# EAGLE design openWall_BasePCB (EAGLE 6.4)
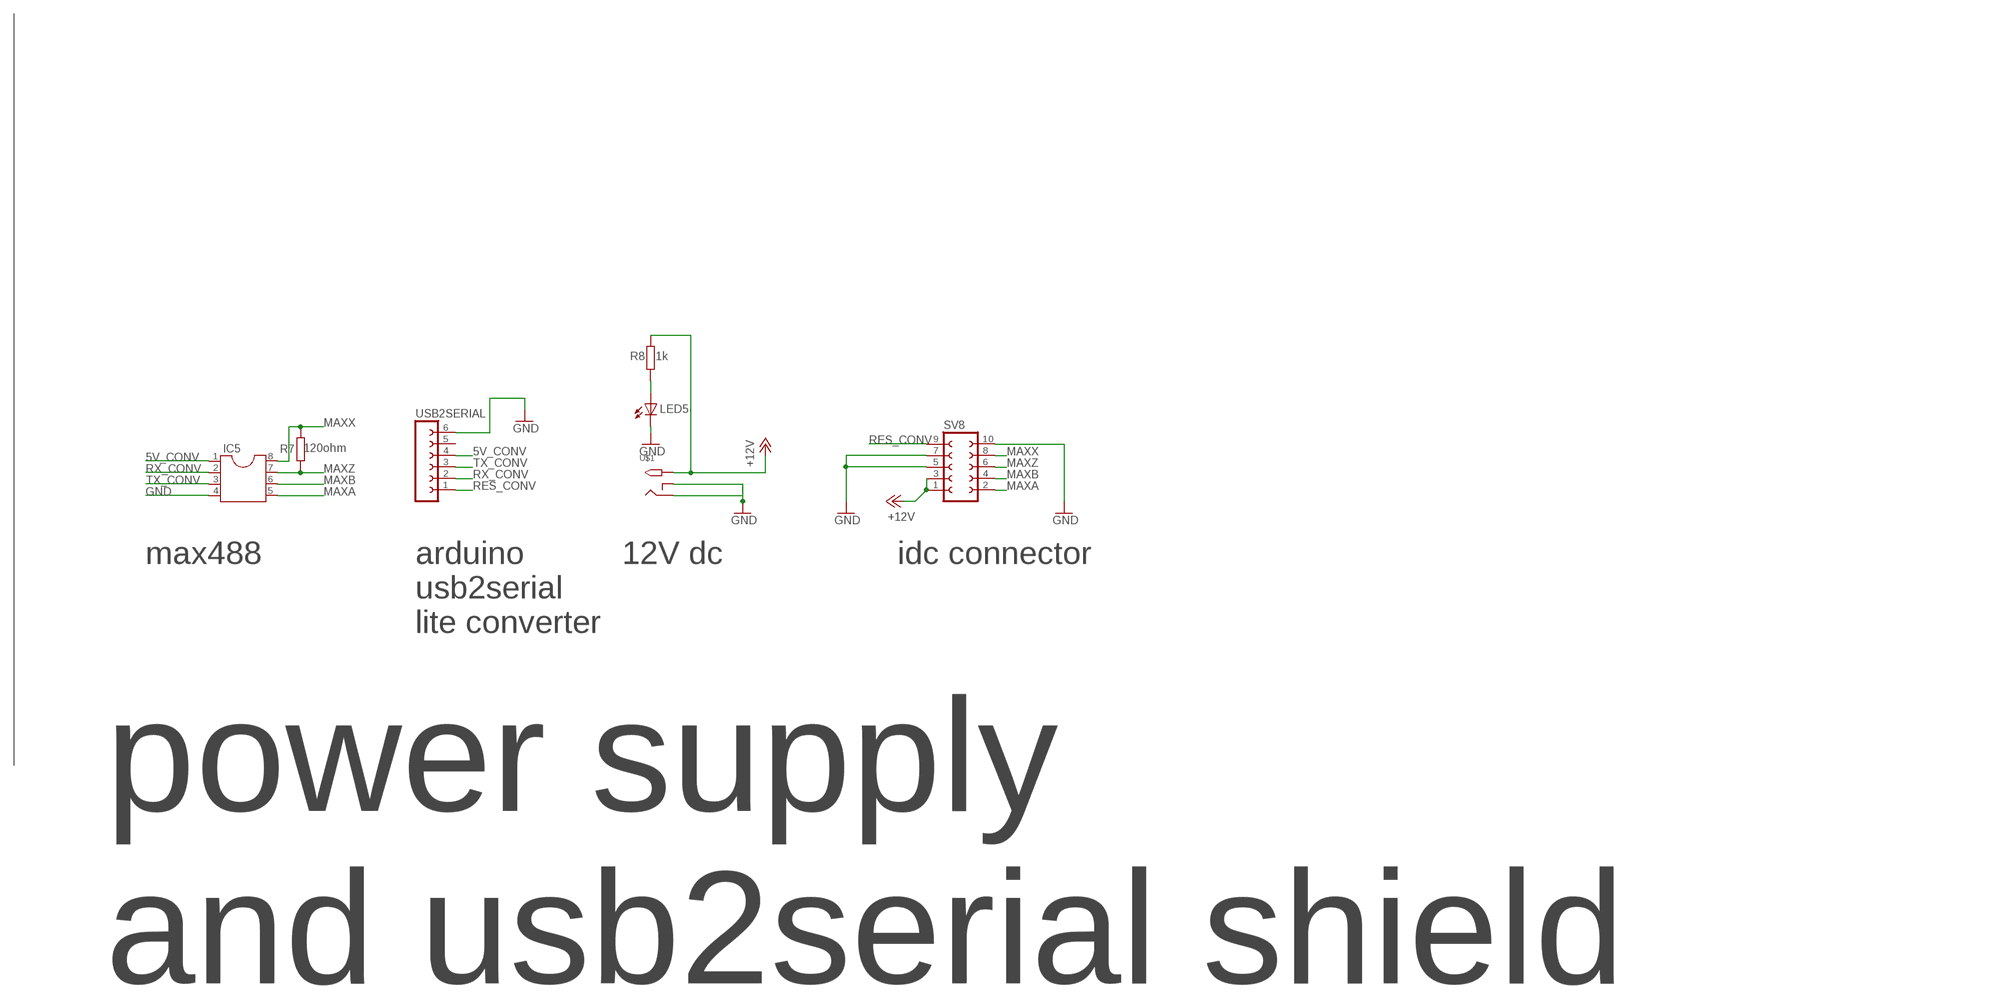
[diagram p0: schematic, sheet 1]

## Parts
IC5  DIL8  [DIL08]
LED5  TLLG4400  [LED3MM]
R7  120ohm  R-EU_0207/7  [0207/7]
R8  1k  R-EU_0207/7  [0207/7]
SV8  FE05-2  [FE05-2]
U$1  2.1MMJACKTHM  [PJ-102A]
USB2SERIAL  FE06-1  [FE06]

## Nets
5V_CONV: IC5.1 USB2SERIAL.4
12V: R8.2 U$1.TIP
+12V: SV8.1 SV8.3
GND: IC5.4 LED5.K(C) SV8.5 SV8.7 SV8.10 U$1.RING U$1.RING_SW USB2SERIAL.6
MAXA: IC5.5 SV8.2
MAXB: IC5.6 SV8.4
MAXX: IC5.8 R7.2 SV8.8
MAXZ: IC5.7 R7.1 SV8.6
N$8: LED5.A R8.1
RES_CONV: SV8.9 USB2SERIAL.1
RX_CONV: IC5.2 USB2SERIAL.2
TX_CONV: IC5.3 USB2SERIAL.3
Unconnected: USB2SERIAL.5

## Notes on the sheet
- max488 | 12V dc | idc connector
- arduino
  usb2serial
  lite converter
- power supply
  and usb2serial shield

## Library data of the parts
IC5 = ic-package:DIL8: Dual In Line / Socket
LED5 = led:TLLG4400: Low Current (2mA) LED 3 mm Tinted Diffused Package color GREEN Source: Data sheet <http://www.farnell.com/datasheets/391098.pdf>; MF: VISHAY SEMICONDUCTOR; OC_FARNELL: 1612435
R7 = rcl:R-EU_: RESISTOR, European symbol
R8 = resistor:R-EU_: RESISTOR, European symbol
SV8 = con-lsta:FE05-2: FEMALE HEADER; OC_FARNELL: unknown; OC_NEWARK: unknown
U$1 = adafruit:2.1MMJACK: 2.1mm x 5.5mm THM DC jack with internal switch. Digikey part #PJ-102A, 4UCON part #05537 2.1mm x 5.5mm SMT DC jack with internal switch. Digikey part #PJ-002A-SMT, 4UCON part #03267 By microbuilder.eu & adafruit.com
USB2SERIAL = con-lsta:FE06-1: FEMALE HEADER; OC_FARNELL: unknown; OC_NEWARK: unknown

## Board
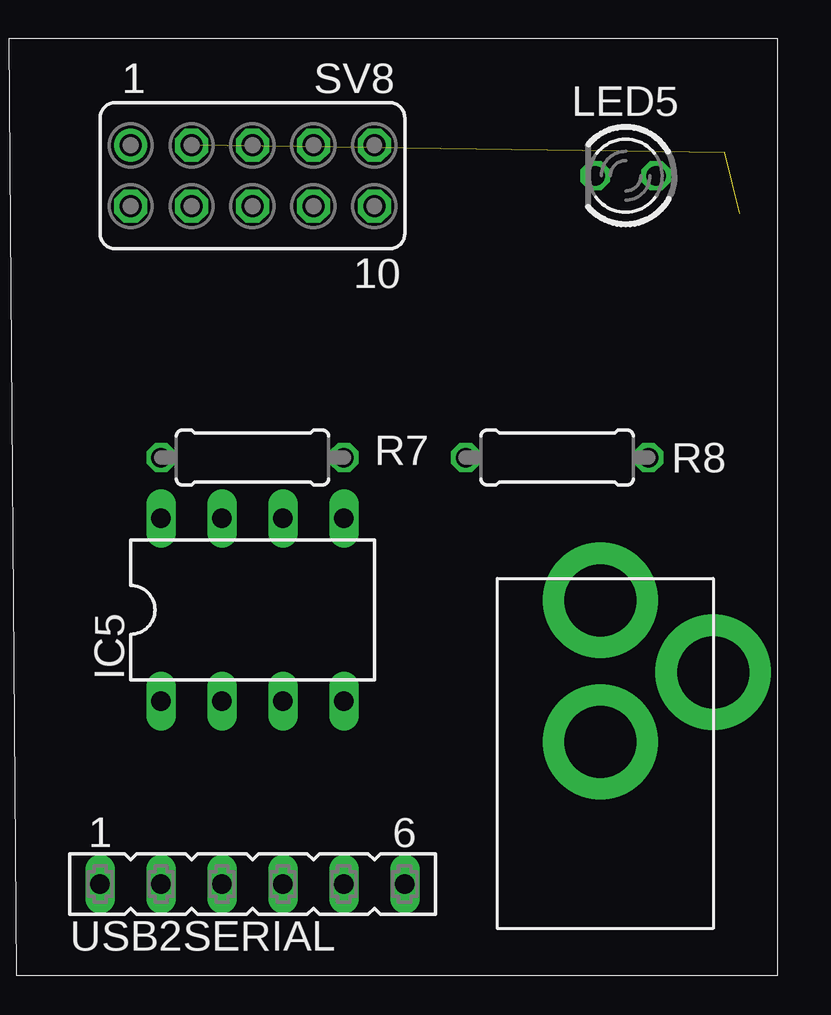
[diagram p1: board, top side]
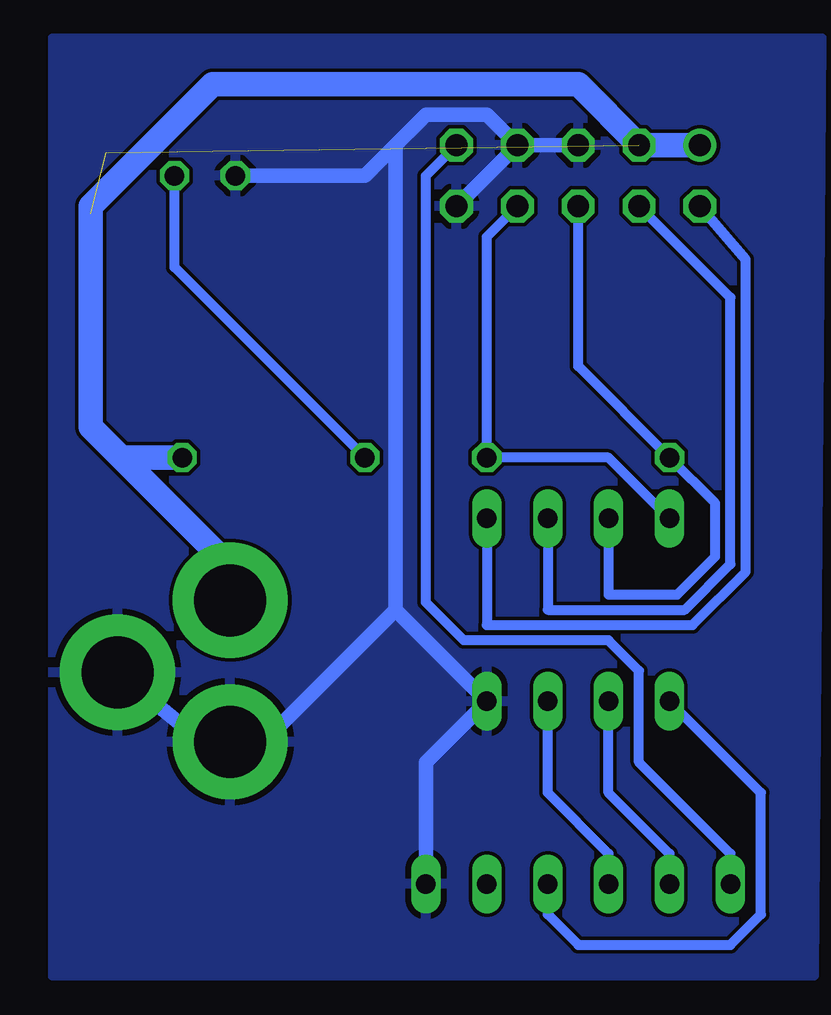
[diagram p2: board, bottom side, seen from below]

No outline drawn. Coordinates in mm, seen from the top.
Copper layers (1*16): Top 0.0356mm / dielectric 1.5011mm / Bottom 0.0356mm
Design rules "LaenPCBOrder": minimum track width 6mil, minimum drill 13mil, track to track 6mil, track to pad 6mil, pad to pad 6mil, via to via 6mil, smd to smd 6mil, copper to edge 15mil, drill to drill 6mil, minimum pad ring 7mil, minimum via ring 7mil, stop-mask expansion 4mil, vias tented up to drill 0mil, thermal gap 10mil

### Footprints (pad centres in the part's own frame; a part is rotated, then mirrored left to right if it is on the bottom)
DIL08 = drill 0.813 long: 1 -3.81,-3.81; 2 -1.27,-3.81; 3 1.27,-3.81; 4 3.81,-3.81; 5 3.81,3.81; 6 1.27,3.81; 7 -1.27,3.81; 8 -3.81,3.81
LED3MM = drill 0.813 octagon: A -1.27,0; K 1.27,0
0207/7 = drill 0.813 octagon: 1 -3.81,0; 2 3.81,0
FE05-2 = drill 0.914: 1 -5.08,1.27 | drill 0.914 octagon: 2 -5.08,-1.27; 3 -2.54,1.27; 4 -2.54,-1.27; 5 0,1.27; 6 0,-1.27; 7 2.54,1.27; 8 2.54,-1.27; 9 5.08,1.27; 10 5.08,-1.27
PJ-102A = drill 3 pad 4.8: RING 0.1,-3.39; RING_SW -4.6,-6.29; TIP 0.1,-9.29
FE06 = drill 0.813 long: 1 -6.35,0; 2 -3.81,0; 3 -1.27,0; 4 1.27,0; 5 3.81,0; 6 6.35,0

### Placement (x,y rotation side)
IC5  8.57,15.24 0 top
LED5  24.13,33.34 180 top
R7  8.57,21.59 0 top
R8  21.27,21.59 0 top
SV8  8.57,33.34 0 top
U$1  23.18,6.35 180 top
USB2SERIAL  8.57,3.81 0 top

### Tracks (layer width: path | path; a pad name or v marks a point on that pad's centre or on a via)
5V_CONV
  Bottom 0.406: USB2SERIAL.4 9.84,2.54 8.57,1.27 2.22,1.27 0.95,2.54 0.95,7.62 IC5.1
12V
  Bottom 1.016: U$1.TIP 23.08,17.05 27.46,21.43 | 27.46,21.43 28.89,22.86 28.89,31.75 | R8.2 27.3,21.59 27.46,21.43
+12V  (2 unrouted)
  Bottom 1.016: SV8.1 SV8.3 8.57,37.15 23.81,37.15 28.89,32.07 28.89,31.75
GND
  Bottom 0.61: U$1.RING_SW 24.24,9.74 U$1.RING 21.69,9.74 16.19,15.24 | SV8.5 SV8.7 | SV8.7 SV8.10 | LED5.K 17.46,33.34 16.19,34.61 | 16.19,34.61 14.92,35.88 12.38,35.88 SV8.7 | 16.19,15.24 16.19,34.61 | USB2SERIAL.6 14.92,8.89 IC5.4 16.19,15.24
  pour Bottom: -1.59,39.05 30.48,39.05 30.48,0 -1.27,0
MAXA
  Bottom 0.406: IC5.5 12.38,14.61 3.81,14.61 1.59,16.83 1.59,29.84 SV8.2
MAXB
  Bottom 0.406: IC5.6 9.84,15.24 4.13,15.24 2.22,17.14 2.22,28.26 SV8.4
MAXX
  Bottom 0.406: IC5.8 7.3,21.59 R7.2 12.38,30.8 SV8.8
MAXZ
  Bottom 0.406: IC5.7 7.3,15.88 4.45,15.88 2.86,17.46 2.86,19.68 R7.1 8.57,25.4 SV8.6
N$8
  Bottom 0.406: R8.1 25.4,29.53 LED5.A
RES_CONV
  Bottom 0.406: USB2SERIAL.1 2.22,5.08 6.03,8.89 6.03,12.7 7.3,13.97 13.34,13.97 14.92,15.56 14.92,33.34 SV8.9
RX_CONV
  Bottom 0.406: USB2SERIAL.2 4.76,5.08 7.3,7.62 IC5.2
TX_CONV
  Bottom 0.406: USB2SERIAL.3 7.3,5.08 9.84,7.62 IC5.3